# Altium schematic sheet Power_TimerEvents.SchDoc
size A
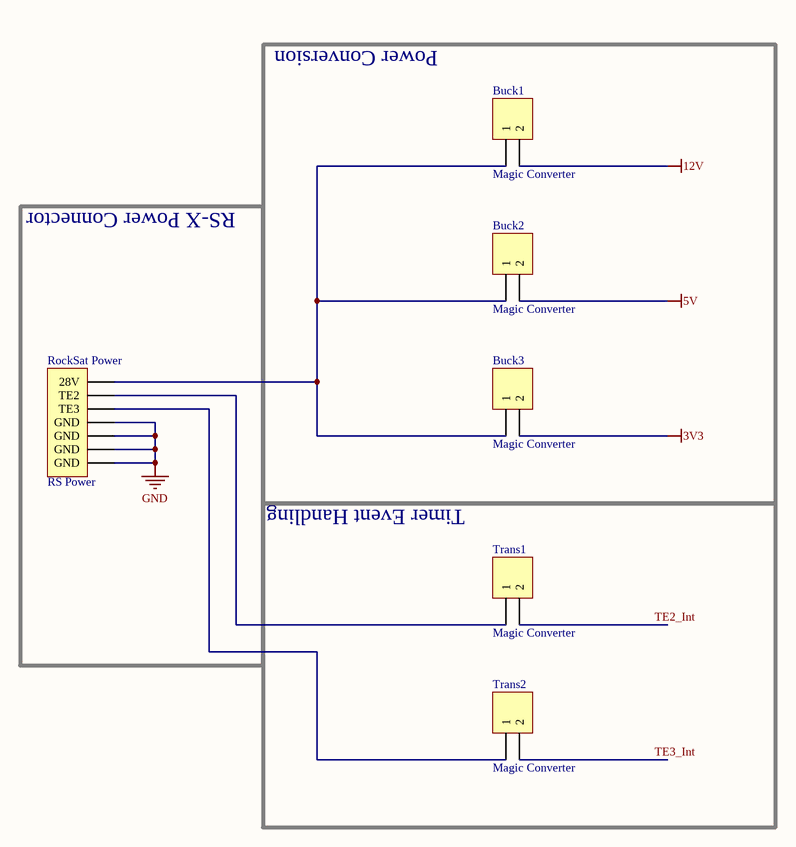
[diagram p0: Power_TimerEvents.SchDoc]

## Parts
Buck1  Magic Converter  [HDR1X2]
Buck2  Magic Converter  [HDR1X2]
Buck3  Magic Converter  [HDR1X2]
RockSat_Power  RS Power  [HDR1X7]
Trans1  Magic Converter  [HDR1X2]
Trans2  Magic Converter  [HDR1X2]

## Blocks framed on the sheet
Power Conversion: Buck1-Buck3
RS-X Power Connector: RockSat_Power
Timer Event Handling: Trans1 Trans2

## Nets
3V3: Buck3.2
5V: Buck2.2
12V: Buck1.2
GND: RockSat_Power.4(GND) RockSat_Power.5(GND) RockSat_Power.6(GND) RockSat_Power.7(GND)
TE2_Int: Trans1.2
TE3_Int: Trans2.2
NetBuck1_1: Buck1.1 Buck2.1 Buck3.1 RockSat_Power.1(28V)
NetRockSat_Power_2: RockSat_Power.2(TE2) Trans1.1
NetRockSat_Power_3: RockSat_Power.3(TE3) Trans2.1

## Library data of the parts
Buck1-Buck3 Trans1 Trans2 = Header 2: Header, 2-Pin; LatestRevisionDate: 17-Jul-2002; LatestRevisionNote: Re-released for DXP Platform.; Publisher: Altium Limited
RockSat_Power = Header 7: Header, 7-Pin; LatestRevisionDate: 17-Jul-2002; LatestRevisionNote: Re-released for DXP Platform.; Publisher: Altium Limited